# Altium schematic sheet Sheet3.SchDoc
size A
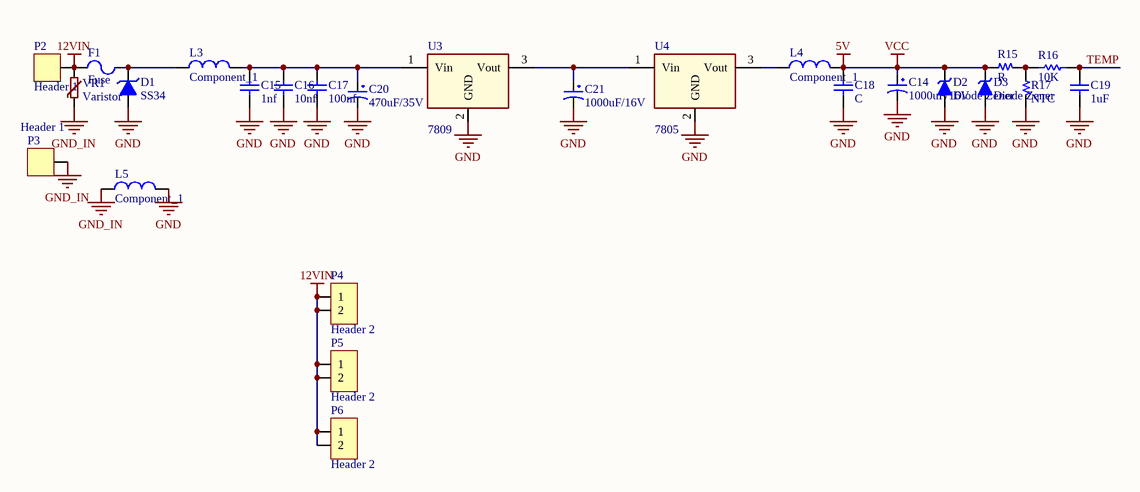
[diagram p0: Sheet3.SchDoc]

## Parts
C14  1000uF/16V  [WCAP-PSHP 8x8.7x3.1]
C15  1nf  [C 0805 (2012)]
C16  10nf  [C 0805 (2012)]
C17  100nf  [C 0805 (2012)]
C18  C  [C 0805 (2012)]
C19  1uF  [C 0805 (2012)]
C20  470uF/35V  [WCAP-PSHP 8x8.7x3.1]
C21  1000uF/16V  [WCAP-PSHP 8x8.7x3.1]
D1  SS34  [DO-214AC (SMA)]
D2  Diode Zener  [SOD-80]
D3  Diode Zener  [SOD-80]
F1  Fuse  [DCAR Fuse holder]
L3  Component_1  [1210]
L4  Component_1  [Inductor SMD 4.8x4.8]
L5  Component_1  [1210]
P2  Header 1  [HDR/Terminal/1/copper/8.8]
P3  Header 1  [HDR/Terminal/1/copper/8.8]
P4  Header 2  [HDR Domino 2]
P5  Header 2  [HDR Domino 2]
P6  Header 2  [HDR Domino 2]
R15  R  [R 0805]
R16  10K  [R 0805 (2012)]
R17  NTC  [R 1/4W/300]
U3  7809  [TO-252 (DPAK)]
U4  7805  [TO-252 (DPAK)]
VR1  Varistor  [VARISTOR DISC 5MM/7MM]

## Nets
5V: C14.1 C18.1 D2.2(K) D3.2(K) L4.2 R15.1  [also labelled VCC]
12VIN: F1.1 P2.1 P4.1 P4.2 P5.1 P5.2 P6.1 P6.2 VR1.1
GND: C14.2 C15.2 C16.2 C17.2 C18.2 C19.2 C20.2 C21.2 D1.1(A) D2.1(A) D3.1(A) L5.2 R17.2 U3.2(GND) U4.2(GND)
GND_IN: L5.1 P3.1 VR1.2
TEMP: C19.1 R16.2
NetC15_1: C15.1 C16.1 C17.1 C20.1 L3.2 U3.1(Vin)
NetC21_1: C21.1 U3.3(Vout) U4.1(Vin)
NetD1_2: D1.2(K) F1.2 L3.1
NetL4_1: L4.1 U4.3(Vout)
NetR15_2: R15.2 R16.1 R17.1

## Library data of the parts
C14 C21 = CP4: Cap 1000uF/16V - 220uF/50V; Description 5: 4,7uF>10uF/250V_3,3uF>10uF/400V - 2,2uF>4,7uF/450V; Description 1: 2200uF-3300uF/6,3V - 1000uF-2200uF/10V; Description 2: 1000uF/16V - 470uF => 1000uF/25V - 100uF/100V; Description 3: 330uF>470uF/35V_220uF>470uF/50V_10uF>22uF/250V; Description 4: 220uF => 330uF/63V - 10uF =>33uF/160 - 200V; Value: 1000uF/16V
C15-C19 = Capacitor NP: Capacitor non-pol
C20 = CP3: Cap 100uF/35V - 470uF/16V; Value: 100uF/35V/50V; Description 1: 1000uF/6,3V - 470uF/16V - 330uF - 25V; Description 2: 220uF/35V - 100uF/50V - 63V - 4,7uF/200V; Description 3: 22uF => 33uF100V - 3,3uF => 4,7uF/250V; Description 4: 2,2uF =>3,3uF/350 - 2,2uF/400V - 1uF/450V
D1 = Zener
D2 D3 = Diode Zener: Zener Diode; Published: 8-Jun-2000; LatestRevisionDate: 17-Jul-2002; LatestRevisionNote: Re-released for DXP Platform.; PackageReference: DIODE-0.7; Publisher: Altium Limited
P2 P3 = Header 1: Header, 1-Pin
P4-P6 = Header 2: Header, 2-Pin; LatestRevisionDate: 17-Jul-2002; LatestRevisionNote: Re-released for DXP Platform.; Publisher: Altium Limited
R15-R17 = Resistor
  R16: Published: 8-Jun-2000; LatestRevisionDate: 17-Jul-2002; LatestRevisionNote: Re-released for DXP Platform.; PackageReference: AXIAL-0.3; Publisher: Altium Limited
U3 U4 = 78xx: LDO Fixed Voltage regulator